# EasyEDA Pro project Glyph.epro

# Schematic YourDisp
Board Name: YourDisp; Create Date: 2026-06-23; Page Name: Sheet_1; Project Name: yourdisp1; Schematic Name: YourDisp; Update Date: 2026-07-09; Add into BOM: yes; Company: Trust Me Bro; Convert to PCB: yes; Date: 2026-05-26; REV: 1.0; Sheet: 1/1; spicePre: .
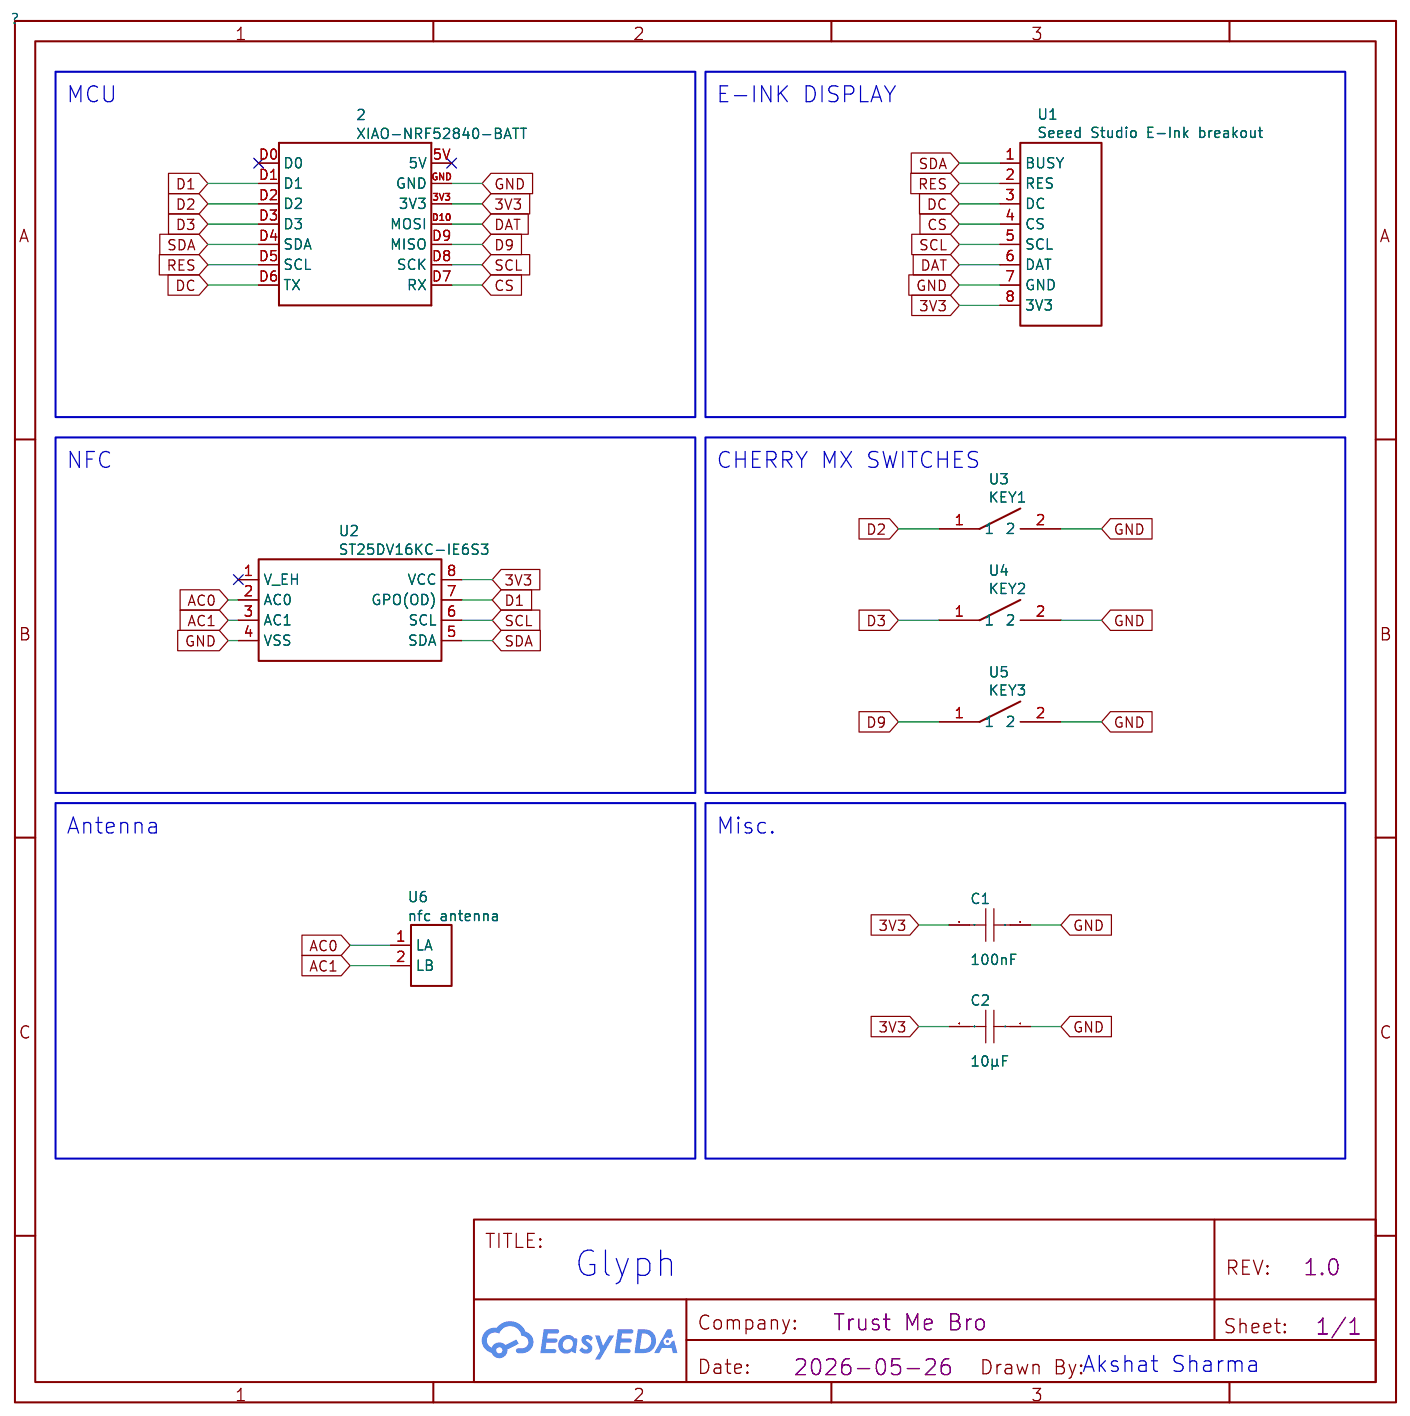
[diagram p0: schematic sheet]

## Parts
2  XIAO-NRF52840-BATT  [XIAO-NRF52840-BATT]
C1  100nF  [C0201]
C2  10µF  [C0201]
U1  Seeed Studio E-Ink breakout  [EPAPER BREAKOUT BOARD FOR SEEED STUDIO XIAO]
U2  ST25DV16KC-IE6S3  [SO-8_L4.9-W3.9-P1.27-LS6.0-BL]
U3  KEY1  [CHERRY-MX_1U]
U4  KEY2  [CHERRY-MX_1U]
U5  KEY3  [CHERRY-MX_1U]
U6  nfc antenna  [NFC ANTENNA1]

## Library data of the parts
2 = XIAO-NRF52840-BATT: Contributor: team6612; spicePre: ?
C1 C2 = CAP_0201: Supplier Footprint: 0201
U1 = Seeed Studio E-Ink breakout: Manufacturer: Seeed Studio; Manufacturer Part: 105990172; Supplier: Digi-Key; link: https://www.seeedstudio.com/ePaper-Breakout-Board-p-5804.html; Contributor: Guest; spicePre: U
U2 = ST25DV16KC-IE6S3: Supplier: LCSC; Supplier Part: C3304274; Manufacturer: ST(意法半导体); JLCPCB Part Class: Extended Part; Contributor: lcsc; spicePre: U
U3 = KEY1: Contributor: tbremner_12; spicePre: U; spiceSymbolName: CHERRY-MX
U4 = KEY2: Contributor: tbremner_12; spicePre: U; spiceSymbolName: CHERRY-MX
U5 = KEY3: Contributor: tbremner_12; spicePre: U; spiceSymbolName: CHERRY-MX
U6 = nfc antenna: Contributor: Guest; spicePre: U

## Nets
3V3: 2.3V3 C1.2 C2.2 U1.8(3V3) U2.8(VCC)
GND: 2.GND C1.1 C2.1 U1.7(GND) U2.4(VSS) U3.2 U4.2 U5.2
AC0: U2.2(AC0) U6.1(LA)
AC1: U2.3(AC1) U6.2(LB)
CS: 2.D7(RX) U1.4(CS)
D1: 2.D1 U2.7(GPO(OD))
D2: 2.D2 U3.1
D3: 2.D3 U4.1
D9: 2.D9(MISO) U5.1
DAT: 2.D10(MOSI) U1.6(DAT)
DC: 2.D6(TX) U1.3(DC)
RES: 2.D5(SCL) U1.2(RES)
SCL: 2.D8(SCK) U1.5(SCL) U2.6(SCL)
SDA: 2.D4(SDA) U1.1(BUSY) U2.5(SDA)

Not connected (* = marked no-connect by the designer): 2 5V* D0*; U2 1(V_EH)*

## Notes on the sheet
- MCU
- E-INK DISPLAY
- NFC
- CHERRY MX SWITCHES
- Antenna
- Misc.
- Glyph
- Akshat Sharma
